# EAGLE design ASD2501 (EAGLE 6.3)
DATABASE: ./../../../../../Components/TinyCircuits_Part_Database.txt
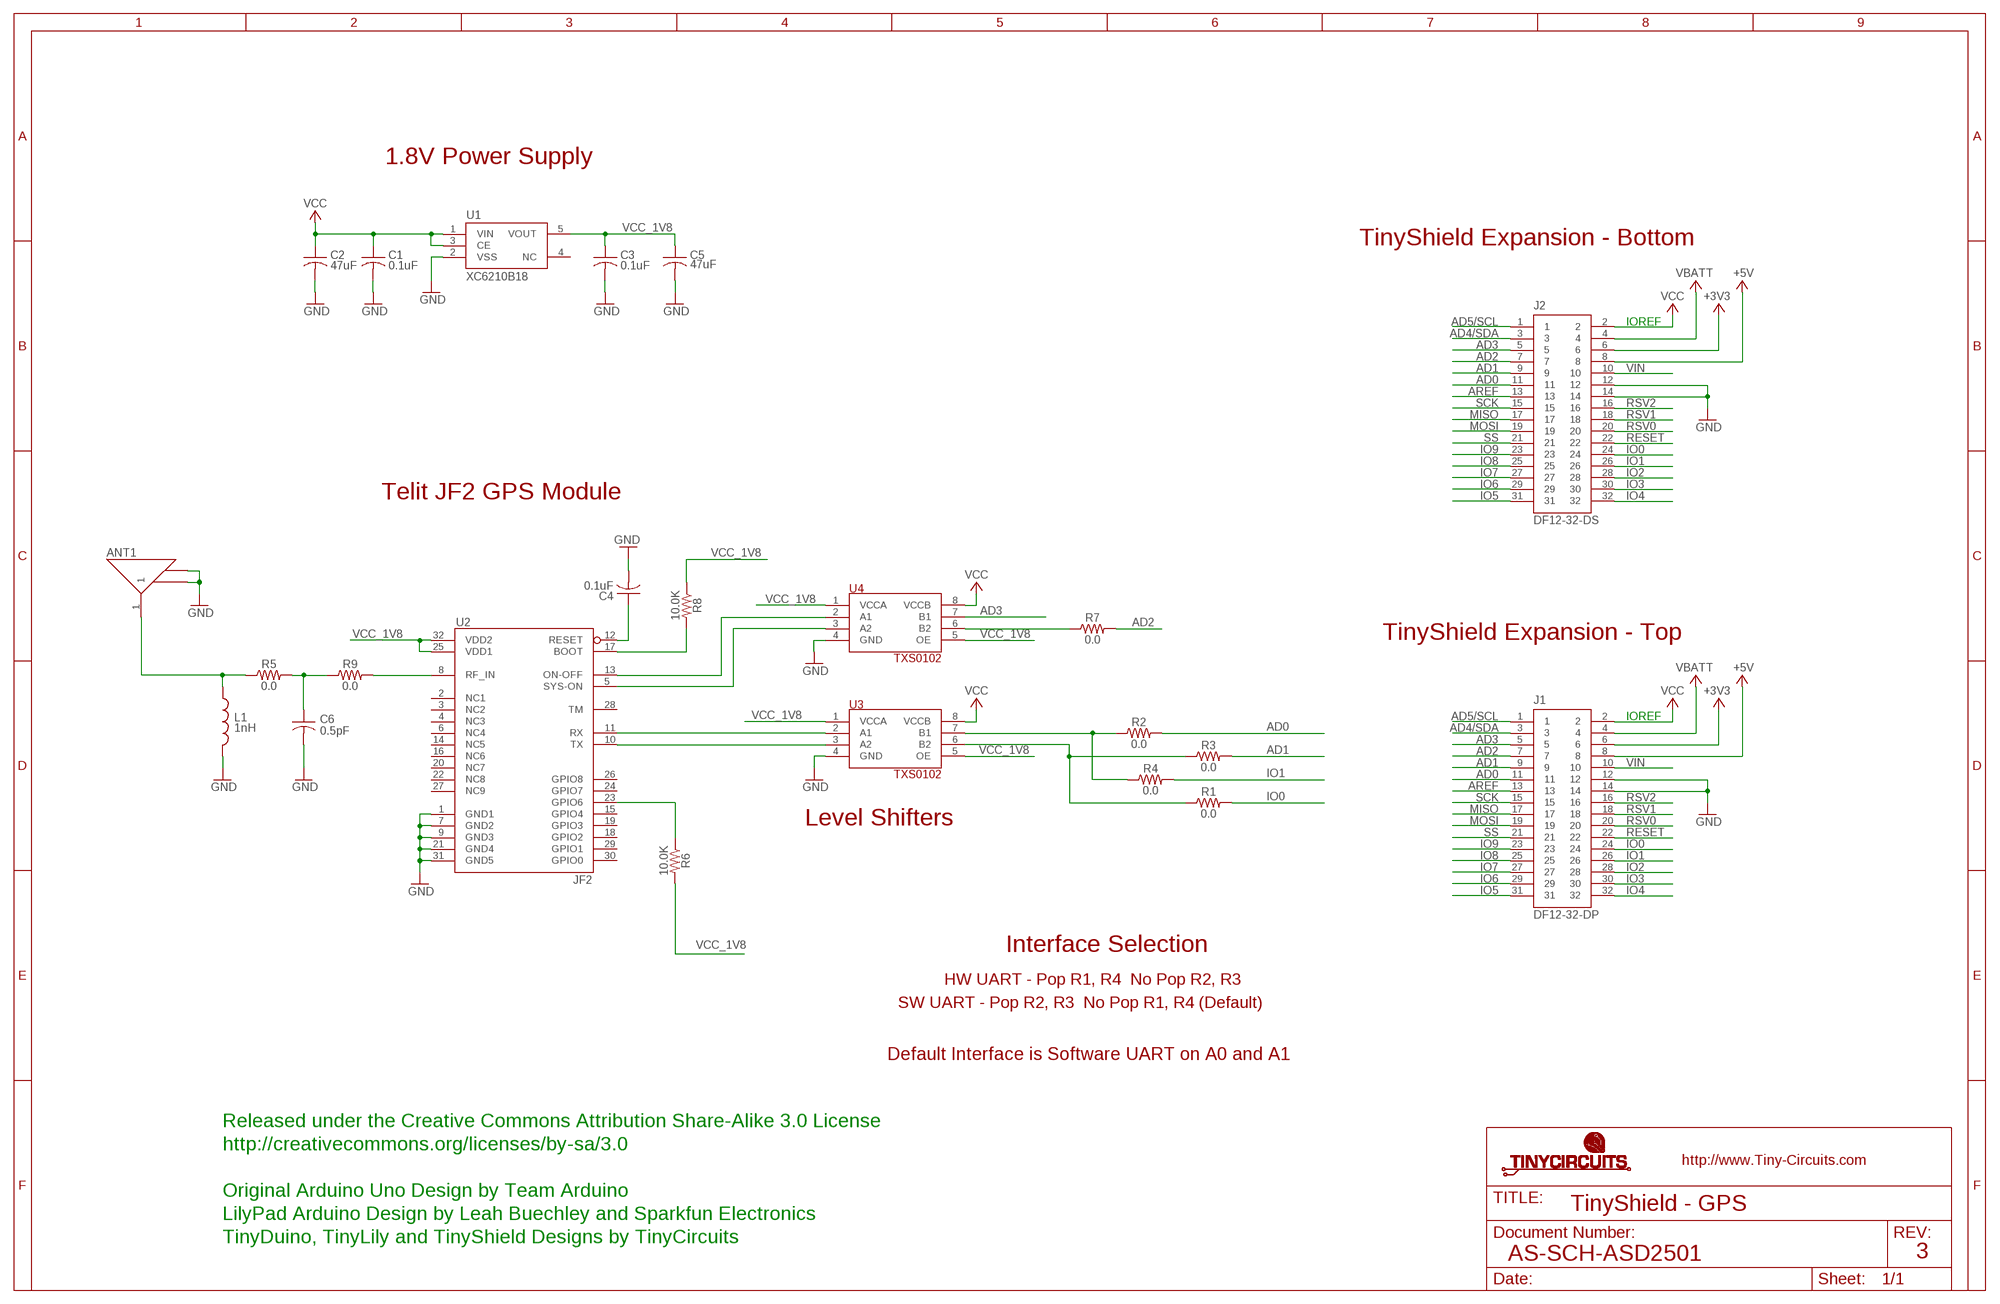
[diagram p0: schematic, sheet 1]

## Parts
ANT1  AS-ITM-00109  [W3011]
C1  0.1uF  AS-ITM-00008  [C0402]
C2  47uF  AS-ITM-00049  [C1206]
C3  0.1uF  AS-ITM-00008  [C0402]
C4  0.1uF  AS-ITM-00008  [C0402]
C5  47uF  AS-ITM-00049  [C1206]
C6  0.5pF  AS-ITM-00126  [C0402]
J1  DF12-32-DP  AS-ITM-00015  [DF12-32-DP]
J2  DF12-32-DS  AS-ITM-00012  [DF12-32-DS]
L1  1nH  AS-ITM-00127  [0402]
R1  0.0  AS-ITM-00076  [0402]
R2  0.0  AS-ITM-000760402_SHORT  [0402_SHORT]
R3  0.0  AS-ITM-000760402_SHORT  [0402_SHORT]
R4  0.0  AS-ITM-00076  [0402]
R5  0.0  AS-ITM-00076  [0402]
R6  10.0K  AS-ITM-00032  [0402]
R7  0.0  AS-ITM-00076  [0402]
R8  10.0K  AS-ITM-00032  [0402]
R9  0.0  AS-ITM-00076  [0402]
U1  XC6210B18  AS-ITM-00075  [SOT-25]
U2  JF2  AS-ITM-00077  [JF2]
U3  TXS0102  AS-ITM-00073  [DQE(R-PX2SON-N8)]
U4  TXS0102  AS-ITM-00073  [DQE(R-PX2SON-N8)]

## Nets
+3V3: J1.6 J2.6
+5V: J1.8 J2.8
AD0: J1.11 J2.11 R2.2
AD1: J1.9 J2.9 R3.2
AD2: J1.7 J2.7 R7.2
AD3: J1.5 J2.5 U4.7(B1)
AD4/SDA: J1.3 J2.3
AD5/SCL: J1.1 J2.1
AREF: J1.13 J2.13
GND: ANT1.2(G1) ANT1.3(G2) C1.2 C2.2 C3.2 C4.2 C5.2 C6.2 J1.12 J1.14 J2.12 J2.14 L1.2 U1.2(VSS) U2.1(GND1) U2.7(GND2) U2.9(GND3) U2.21(GND4) U2.31(GND5) U3.4(GND) U4.4(GND)
IO0: J1.24 J2.24 R1.2
IO1: J1.26 J2.26 R4.2
IO2: J1.28 J2.28
IO3: J1.30 J2.30
IO4: J1.32 J2.32
IO5: J1.31 J2.31
IO6: J1.29 J2.29
IO7: J1.27 J2.27
IO8: J1.25 J2.25
IO9: J1.23 J2.23
MISO: J1.17 J2.17
MOSI: J1.19 J2.19
N$1: C6.1 R5.2 R9.1
N$2: R2.1 R4.1 U3.7(B1)
N$3: R1.1 R3.1 U3.6(B2)
N$4: U2.11(RX) U3.2(A1)
N$5: ANT1.1 L1.1 R5.1
N$6: R6.1 U2.23(GPIO6)
N$7: U2.10(TX) U3.3(A2)
N$8: C4.1 U2.12(RESET)
N$9: R9.2 U2.8(RF_IN)
N$10: R8.2 U2.17(BOOT)
N$11: U2.13(ON-OFF) U4.2(A1)
N$12: U2.5(SYS-ON) U4.3(A2)
N$13: R7.1 U4.6(B2)
RESET: J1.22 J2.22
RSV0: J1.20 J2.20
RSV1: J1.18 J2.18
RSV2: J1.16 J2.16
SCK: J1.15 J2.15
SS: J1.21 J2.21
VBATT: J1.4 J2.4
VCC: C1.1 C2.1 J1.2 J2.2 U1.1(VIN) U1.3(CE) U3.8(VCCB) U4.8(VCCB)
VCC_1V8: C3.1 C5.1 R6.2 R8.1 U1.5(VOUT) U2.25(VDD1) U2.32(VDD2) U3.1(VCCA) U3.5(OE) U4.1(VCCA) U4.5(OE)
VIN: J1.10 J2.10
Unconnected: U1.4(NC) U2.2(NC1) U2.3(NC2) U2.4(NC3) U2.6(NC4) U2.14(NC5) U2.15(GPIO4) U2.16(NC6) U2.18(GPIO2) U2.19(GPIO3) U2.20(NC7) U2.22(NC8) U2.24(GPIO7) U2.26(GPIO8) U2.27(NC9) U2.28(TM) U2.29(GPIO1) U2.30(GPIO0)

## Notes on the sheet
- 1.8V Power Supply
- TinyShield Expansion - Bottom
- IOREF
- Telit JF2 GPS Module
- TinyShield Expansion - Top
- IOREF
- Level Shifters
- Interface Selection
- HW UART - Pop R1, R4  No Pop R2, R3
- SW UART - Pop R2, R3  No Pop R1, R4 (Default)
- Default Interface is Software UART on A0 and A1
- Released under the Creative Commons Attribution Share-Alike 3.0 License
- http://creativecommons.org/licenses/by-sa/3.0
- Original Arduino Uno Design by Team Arduino
- TinyShield - GPS
- LilyPad Arduino Design by Leah Buechley and Sparkfun Electronics
- TinyDuino, TinyLily and TinyShield Designs by TinyCircuits
- AS-SCH-ASD2501 | 3

## Library data of the parts
ANT1 = tinycircuits:AS-ITM-00109: ANTENNA GPS CERAMIC 1.575GHZ; PARTNO: AS-ITM-00109; VALUE: W3011A
C1 C3 C4 = tinycircuits:AS-ITM-00008: CAP CER 0.1UF 16V 10% X5R 0402; PARTNO: AS-ITM-00008
C2 C5 = tinycircuits:AS-ITM-00049: CAP CER 47UF 6.3V 20% X6S 1206; PARTNUM: AS-ITM-00049
C6 = tinycircuits:AS-ITM-00126: CAP CER 0.5PF 16V 0.1% 0402
J1 = tinycircuits:AS-ITM-00015: CONN HEADER 32POS 3MM SMD 0.5MM; PARTNO: AS-ITM-00015
J2 = tinycircuits:AS-ITM-00012: CONN RECEPT 32POS 3MM SMD 0.5MM; PARTNO: AS-ITM-00012
L1 = tinycircuits:AS-ITM-00127: INDUCTOR 1NH
R1 R4 R5 R7 R9 = tinycircuits:AS-ITM-00076: RES 0.0 OHM 1/16W 1% 0402 SMD; PARTNO: AS-ITM-00076
R2 R3 = tinycircuits:AS-ITM-00076: RES 0.0 OHM 1/16W 1% 0402 SMD
R6 R8 = tinycircuits:AS-ITM-00032: RES 10.0K OHM 1/16W 1% 0402 SMD; PARTNO: AS-ITM-00032
U1 = tinycircuits:AS-ITM-00075: IC REG LDO 1.8V .7A SOT-25; PARTNO: AS-ITM-00075
U2 = tinycircuits:AS-ITM-00077: Telit JF2 GPS Module; PARTNO: AS-ITM-00077
U3 U4 = tinycircuits:AS-ITM-00073: TI 2-Bit Bidirectional Voltage-Level Translator; PARTNO: AS-ITM-00073

## Board
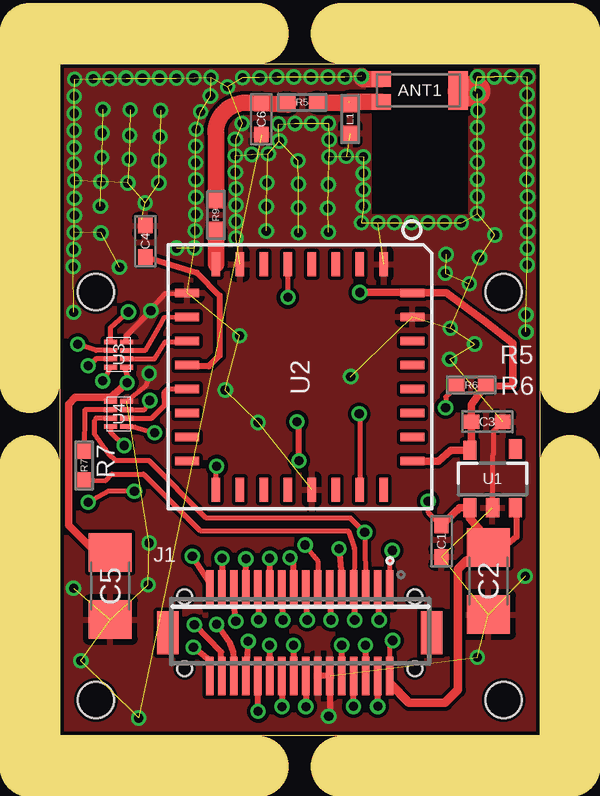
[diagram p1: board, top side]
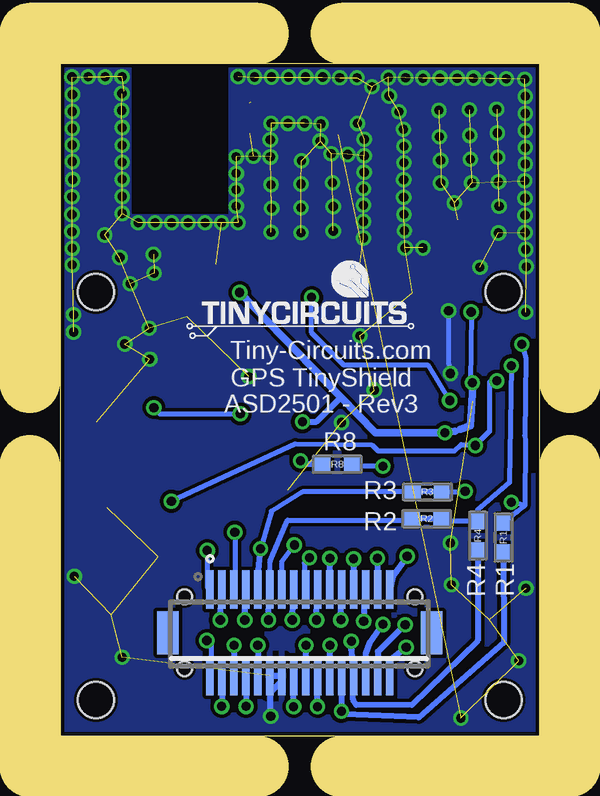
[diagram p2: board, bottom side, seen from below]

Size 20 x 28 mm. Coordinates in mm from the lower left corner, seen from the top.
Outline: 0,28 20,28 20,0 0,0 0,28
Copper layers (1*16): Top 0.035mm / dielectric 1.5mm / Bottom 0.035mm
Design rules "default *": minimum track width 8mil, minimum drill 15mil, track to track 6mil, track to pad 6mil, pad to pad 6mil, via to via 6mil, smd to smd 6mil, copper to edge 6mil, drill to drill 8mil, minimum pad ring 10mil, minimum via ring 5mil, stop-mask expansion 4mil, vias tented up to drill 25mil, thermal gap 10mil
Holes 1.5 mm at 1.5,18.5 18.5,18.5 18.5,1.5 1.5,1.5
tRestrict: area 13,21.8 to 17,28
bRestrict: area 13,21.8 to 17,28
Milling: 8 lines

### Footprints (pad centres in the part's own frame; a part is rotated, then mirrored left to right if it is on the bottom)
W3011 = smd 0.8 x 0.65: 1 1.6,0.475; 2 1.6,-0.475 | smd 0.8 x 1.6: 3 -1.6,0
C0402 = smd 0.65 x 0.6: 1 -0.65,0; 2 0.65,0
C1206 = smd 1.6 x 1.8: 1 -1.4,0; 2 1.4,0
DF12-32-DP = smd 0.3 x 1.6: 1 -3.75,-1.8; 2 -3.75,1.8; 3 -3.25,-1.8; 4 -3.25,1.8; 5 -2.75,-1.8; 6 -2.75,1.8; 7 -2.25,-1.8; 8 -2.25,1.8; 9 -1.75,-1.8; 10 -1.75,1.8; 11 -1.25,-1.8; 12 -1.25,1.8; 13 -0.75,-1.8; 14 -0.75,1.8; 15 -0.25,-1.8; 16 -0.25,1.8; 17 0.25,-1.8; 18 0.25,1.8; 19 0.75,-1.8; 20 0.75,1.8; 21 1.25,-1.8; 22 1.25,1.8; 23 1.75,-1.8; 24 1.75,1.8; 25 2.25,-1.8; 26 2.25,1.8; 27 2.75,-1.8; 28 2.75,1.8; 29 3.25,-1.8; 30 3.25,1.8; 31 3.75,-1.8; 32 3.75,1.8 | smd 0.9 x 1.8: F1 -5.5,0; F2 5.5,0 | hole 0.6: -4.8,1.5; 4.8,1.5
DF12-32-DS = smd 0.3 x 1.6: 1 -3.75,1.8; 2 -3.75,-1.8; 3 -3.25,1.8; 4 -3.25,-1.8; 5 -2.75,1.8; 6 -2.75,-1.8; 7 -2.25,1.8; 8 -2.25,-1.8; 9 -1.75,1.8; 10 -1.75,-1.8; 11 -1.25,1.8; 12 -1.25,-1.8; 13 -0.75,1.8; 14 -0.75,-1.8; 15 -0.25,1.8; 16 -0.25,-1.8; 17 0.25,1.8; 18 0.25,-1.8; 19 0.75,1.8; 20 0.75,-1.8; 21 1.25,1.8; 22 1.25,-1.8; 23 1.75,1.8; 24 1.75,-1.8; 25 2.25,1.8; 26 2.25,-1.8; 27 2.75,1.8; 28 2.75,-1.8; 29 3.25,1.8; 30 3.25,-1.8; 31 3.75,1.8; 32 3.75,-1.8 | smd 0.9 x 1.8: F1 -5.5,0; F2 5.5,0 | hole 0.6: -4.8,1.5; 4.8,1.5
0402 = smd 0.65 x 0.55: 1 -0.6,0; 2 0.6,0
0402_SHORT = smd 0.65 x 0.55: 1 -0.6,0; 2 0.6,0
SOT-25 = smd 0.55 x 0.8: 1 -0.95,-1.2; 2 0,-1.2; 3 0.95,-1.2; 4 0.95,1.25; 5 -0.95,1.2
JF2 = smd 1 x 0.35: 1 -4.7,3.5; 2 -4.7,2.5; 3 -4.7,1.5; 4 -4.7,0.5; 5 -4.7,-0.5; 6 -4.7,-1.5; 7 -4.7,-2.5; 8 -4.7,-3.5; 17 4.7,-3.5; 18 4.7,-2.5; 19 4.7,-1.5; 20 4.7,-0.5; 21 4.7,0.5; 22 4.7,1.5; 23 4.7,2.5; 24 4.7,3.5 | smd 0.35 x 1: 9 -3.5,-4.7; 10 -2.5,-4.7; 11 -1.5,-4.7; 12 -0.5,-4.7; 13 0.5,-4.7; 14 1.5,-4.7; 15 2.5,-4.7; 16 3.5,-4.7; 25 3.5,4.7; 26 2.5,4.7; 27 1.5,4.7; 28 0.5,4.7; 29 -0.5,4.7; 30 -1.5,4.7; 31 -2.5,4.7; 32 -3.5,4.7
DQE(R-PX2SON-N8) = smd 0.2 x 0.53: 1 -0.525,-0.335; 2 -0.175,-0.335; 3 0.175,-0.335; 4 0.525,-0.335; 5 0.525,0.335; 6 0.175,0.335; 7 -0.175,0.335; 8 -0.525,0.335

### Placement (x,y rotation side)
ANT1  15,26.89 180 top
C1  15.91,8.11 270 top
C2  17.86,6.45 270 top
C3  17.81,13.09 0 top
C4  3.56,20.61 90 top
C5  2.1,6.24 270 top
C6  8.4,25.7 270 top
J1  10,4.3 180 top
J2  10,4.3 0 bottom
L1  12.1,25.7 270 top
R1  1.51,8.26 270 bottom
R2  4.71,9.05 180 bottom
R3  4.68,10.17 180 bottom
R4  2.57,8.34 270 bottom
R5  10.1,26.4 180 top
R6  17.15,14.61 0 top
R7  1.01,11.26 270 top
R8  8.44,11.31 0 bottom
R9  6.5,21.7 270 top
U1  18.04,10.7 0 top
U2  10,14.95 270 top
U3  2.45,15.88 90 top
U4  2.45,13.41 90 top
U$1  [DOCFIELD-TINYCIRCUITS-PCB]  33.91,-10 0 top  (outside the outline)

### Tracks (layer width: path | path; a pad name or v marks a point on that pad's centre or on a via)
+3V3  (via drill 0.38)
  Top 0.254: J2.6 v12.75,3.77 v12.74,3.77
  Bottom 0.254: v12.74,3.77 12.74,2.51 J2.6
+5V  (via drill 0.38)
  Top 0.254: v12.24,1.23 J2.8
  Bottom 0.254: J2.8 12.25,1.21 v12.24,1.23
AD0  (via drill 0.38)
  Top 0.254: v11.3,4.83 11.31,5.05 J2.11
  Bottom 0.203: J2.11 11.22,6.1 11.24,7.27 10.5,8.99 5.37,8.99 R2.2
  Bottom 0.254: J2.11 11.28,5.79 v11.3,4.83
AD1  (via drill 0.38)
  Top 0.254: J2.9 11.79,6.27 v11.63,7.8
  Bottom 0.203: R3.2 9.89,10.17 11.18,9.36 11.6,7.92 v11.63,7.8
  Bottom 0.254: v11.63,7.8 11.78,6.22 J2.9
AD2  (via drill 0.38)
  Top 0.203: R7.2 1.9,10.64 2.17,10.9 3.49,10.9 5.85,8.55 12.03,8.54 12.28,7.81 J2.7
  Top 0.254: v12.29,4.83 12.31,5.05 J2.7
  Bottom 0.254: J2.7 12.27,5.86 v12.29,4.83
AD3  (via drill 0.38)
  Top 0.203: U4.7 2.06,13.24 1.51,13.24 1.43,13.11 1.43,12.58 1.89,11.95 2.04,11.74 2.32,11.46 3.72,11.46 6.1,9.07 12.12,9.07 v12.71,8.49 12.73,8.44 J2.5
  Bottom 0.203: 12.75,6.44 J2.5 12.71,6.14 v12.71,8.49
AD4/SDA  (via drill 0.38)
  Top 0.254: v13.31,4.83 13.31,5 J2.3
  Bottom 0.254: J2.3 13.28,5.86 v13.31,4.83
AD5/SCL  (via drill 0.38)
  Top 0.203: J2.1 13.75,7.61 v13.86,7.72
  Bottom 0.203: v13.86,7.72 13.86,6.21 J2.1
AREF  (via drill 0.38)
  Top 0.203: v10.23,7.95 10.55,7.53 10.75,7.27 J2.13
  Bottom 0.203: J2.13 10.75,7.27 v10.23,7.95
GND  (via drill 0.38)  (152 unrouted)
  Top 0.203: U2.9 4.38,18.42 2.76,16.6 U3.4 2.77,16.41 2.75,16.59 2.75,16.67 v3.79,17.71 | C3.2 18.07,12.69 18.07,11.72 18.04,11.69 U1.2 | v3.72,15.09 3.56,14.57 U4.4
  Top 0.254: J2.12 J2.14 | J2.12 11.25,1.04 11.21,1 v11.21,0.82 | v11.21,0.82 11.21,0.79 11.23,0.77 | J2.12 11.25,0.86 v11.21,0.82 | C4.2 3.61,21.3 3.41,21.5
  Top 0.686: ANT1.2 12.69,27.36 arc-90 v12.57,27.48 | ANT1.3 16.77,26.89 arc-90 16.8,26.85 | 17.32,26.85 arc-90 v17.41,26.76
  Top 1.27: 16.8,26.85 17.32,26.85
  Bottom 0.203: v3.79,17.71 3.79,15.55 v3.72,15.09
  Bottom 0.254: J2.12 J2.14 10.75,2.29 11.25,1.79 11.25,0.86 v11.21,0.82
  other vias: 5.66,23.17 5.66,22.44 5.66,21.73 0.57,6.15 0.87,3.13 3.28,0.74 3.72,8.03 6.89,14.41 12.12,14.97 0.6,22.4 16.74,21.38 0.61,23.13 4.86,27.41 5.59,27.42 19.4,6.65 6.3,27.43 3.55,22.21 5.68,25.28 19.47,23.18 19.5,22.46 19.48,20.31 17.29,16.33 17.4,3.27 3.68,6.29 8.26,13.06 7.49,16.67 2.48,19.52 17.41,27.47 17.43,26.05 18.11,27.46 18.82,27.47 19.5,27.45 19.48,26.72 19.49,26.02 19.49,25.31 19.49,24.62 16.25,15.69 16.28,16.99 17.41,25.34 17.41,24.61 17.41,23.9 17.41,23.18 17.41,22.47 17.41,21.76 19.49,23.93 19.5,21.72 19.5,21.01 19.48,19.62 19.43,17.54 19.43,16.83 16.08,19.27 16.1,20.06 16.03,21.38 15.34,21.38 14.66,21.38 13.94,21.38 13.26,21.38 12.57,21.38 12.65,22.06 12.65,22.75 12.65,23.44 12.65,24.12 11.94,24.15 11.23,24.12 11.23,24.83 11.2,25.52 10.49,25.52 9.8,25.52 9.12,25.49 9.14,24.78 8,24.22 8.69,24.25 7.32,24.17 7.59,25.52 7.32,24.86 7.32,23.49 7.34,22.8 7.34,22.12 7.34,21.43 7.34,20.74 11.89,27.45 11.18,27.45 10.46,27.45 9.75,27.45 9.04,27.45 8.33,27.42 7.62,27.42 6.98,27.04 6.27,26.66 5.87,26 5.65,24.57 5.65,23.88 5.63,21.04 5.61,20.33 4.87,20.33 9.93,23.96 8.63,23.04 9.95,22.99 11.2,22.97 8.61,22.05 8.61,21.04 9.95,22 9.95,20.96 11.17,21.98 11.2,20.99 18.14,20.87 17.5,19.93 17.07,18.84 4.15,27.41 3.44,27.41 2.75,27.41 2.07,27.38 1.38,27.38 0.62,27.36 0.59,26.64 0.59,25.93 0.59,25.22 0.59,24.51 0.59,23.82 0.6,21.69 0.6,20.97 0.58,20.26 0.55,19.55 0.58,17.65 1.79,26.11 2.93,26.09 4.2,26.06 1.76,25.12 1.74,24.1 1.71,23.09 1.69,22.07 1.71,20.95 2.91,25.02 2.88,24.03 4.18,24.97 4.12,23.98 2.83,23.04 4.12,23.04
  pour Top: 0.25,27.75 19.75,27.75 19.75,0.25 0.25,0.25
  pour Bottom: 0.25,27.75 19.75,27.75 19.75,0.25 0.25,0.25
IO0  (via drill 0.38)
  Top 0.254: v8.26,1.02 8.25,0.85 J2.24
  Bottom 0.254: J2.24 8.24,2.5 v8.26,1.02 8.19,0.9 5.04,0.77 1.48,3.89 R1.2
IO1  (via drill 0.38)
  Top 0.254: v7.85,3.94 J2.26
  Bottom 0.254: J2.26 7.85,3.66 | J2.26 v7.85,3.94 | R4.2 2.57,3.97 5.34,1.28 7.64,1.29 7.78,1.51 7.78,2.47 J2.26
IO2  (via drill 0.38)
  Top 0.254: v6.53,4.64 7.07,3.89 7.22,3.49 7.29,2.61 7.26,2.51 J2.28
  Bottom 0.254: J2.28 7.24,3.43 7.07,3.88 v6.53,4.64
IO3  (via drill 0.38)
  Top 0.254: J2.30 6.73,3.49 v5.61,4.63
  Bottom 0.254: v5.61,4.63 6.75,3.51 6.77,2.53 J2.30
IO4  (via drill 0.38)
  Top 0.254: J2.32 6.25,3.14 v5.56,3.69
  Bottom 0.254: v5.56,3.69 5.61,3.65 6.21,3.18 6.21,3.14 6.26,3.1 J2.32
IO5  (via drill 0.38)
  Top 0.254: v5.52,7.49 6.23,6.38 J2.31
  Bottom 0.254: J2.31 6.11,6.64 v5.52,7.49
IO6  (via drill 0.38)
  Top 0.254: J2.29 6.76,6.11 v6.76,7.4
  Bottom 0.254: J2.29 6.75,7.39 v6.76,7.4
IO7  (via drill 0.38)
  Top 0.254: v7.33,4.78 7.31,4.9 J2.27
  Bottom 0.254: J2.27 7.29,5.76 v7.33,4.78
IO8  (via drill 0.38)
  Top 0.254: J2.25 v7.75,7.37
  Bottom 0.254: v7.75,7.37 J2.25
IO9  (via drill 0.38)
  Top 0.254: v8.29,4.83 8.31,4.98 J2.23
  Bottom 0.254: J2.23 8.28,5.59 v8.29,4.83
MISO  (via drill 0.38)
  Top 0.254: J2.17 9.75,7.29 v9.59,7.42
  Bottom 0.203: v9.59,7.42 9.56,7.33 9.8,7.21 9.8,6.15 J2.17
  Bottom 0.254: 9.74,6.11 J2.17
MOSI  (via drill 0.38)
  Top 0.254: v9.3,4.83 9.31,4.95 J2.19
  Bottom 0.254: J2.19 9.27,5.76 v9.3,4.83
N$1
  Top 0.406: 9.4,26.38 9.4,26.4 R5.2 9.5,26.3 | 6.49,25.12 6.5,25.12 | 8.35,26.38 8.4,26.38 C6.1
  Top 0.686: 9.4,26.38 9.5,26.38 | 6.49,25.12 arc-90 7.75,26.38 8.35,26.38 | 6.5,25.12 R9.1 | C6.1 9.5,26.3
N$2  (via drill 0.38)
  Top 0.203: U3.7 1.51,15.7 1.33,15.53 1.23,15.45 1.25,15.4 v1.18,15.43
  Bottom 0.203: v1.18,15.43 1.25,10.55 2.57,9.43 R4.1 3.99,8.94 R2.1
N$3  (via drill 0.38)
  Top 0.203: U3.6 1.5,16.06 v0.74,16.31 | v3.11,10.19 2.01,10.19 v1.18,9.74
  Bottom 0.203: v0.74,16.31 0.57,15.73 0.62,12.5 0.59,12.3 0.62,9.58 | 0.62,9.58 0.95,9.33 1.49,8.86 R1.1 | R3.1 3.13,10.17 v3.11,10.19 | v1.18,9.74 0.92,9.71 0.62,9.58
N$4
  Top 0.203: U3.2 3.1,15.71 3.69,15.71 3.94,15.71 4.38,16.42 5.26,16.42 U2.11
N$5  (1 unrouted)
  Top 0.406: 10.7,26.38 R5.1 | 12.1,26.38 L1.1
  Top 0.686: ANT1.1 12.03,26.41 | 10.7,26.38 12.1,26.38
N$6  (via drill 0.38)
  Top 0.203: R6.1 16.09,14.12 v16.09,13.67 | v12.48,13.42 12.5,13.4 U2.23
  Bottom 0.203: v16.09,13.67 15.83,13.42 v12.48,13.42
N$7
  Top 0.203: U3.3 3.56,16.07 4.17,17.1 4.35,17.43 U2.10
N$8
  Top 0.254: C4.1 5.71,19.3 6.66,18.35 6.66,15.86 6.2,15.4 5.36,15.4 U2.12
N$9
  Top 0.406: R9.2 6.5,20.9
  Top 0.686: U2.8 6.5,20.9 6.5,20.99
N$10  (via drill 0.38)
  Top 0.203: U2.17 6.5,11.2 v6.54,11.23
  Bottom 0.203: v6.54,11.23 7.65,11.23 7.84,11.22 7.83,11.22 R8.2
N$11
  Top 0.203: U4.2 3.82,13.24 4.36,13.77 4.35,14.31 4.5,14.45 U2.13
N$12  (via drill 0.38)
  Top 0.203: U4.3 2.8,13.59 3.52,13.59 3.74,13.93 v3.75,13.97 | v9.51,18.27 v9.5,18.28 U2.5
  Bottom 0.203: v3.75,13.97 4.64,15.44 8.16,15.45 9.51,16.8 v9.51,18.27
N$13
  Top 0.203: U4.6 2.08,13.59 1.04,13.58 1.04,13.53 R7.1
RESET  (via drill 0.38)
  Top 0.254: v8.74,3.77 J2.22
  Bottom 0.254: J2.22 8.75,3.69 v8.74,3.77
RSV0  (via drill 0.38)
  Top 0.254: J2.20 9.25,1.2 v9.26,1.22
  Bottom 0.254: v9.26,1.22 J2.20
RSV1  (via drill 0.38)
  Top 0.254: v9.74,3.77 9.74,2.51 J2.18
  Bottom 0.254: J2.18 9.75,3.72 v9.74,3.77
RSV2  (via drill 0.38)
  Top 0.254: J2.16 10.25,1.16 v10.25,1.22
  Bottom 0.254: v10.25,1.22 J2.16
SCK  (via drill 0.38)
  Top 0.254: v10.31,4.83 10.31,4.98 J2.15
  Bottom 0.254: J2.15 10.29,5.66 v10.31,4.83
SS  (via drill 0.38)
  Top 0.254: v8.75,7.4 J2.21
  Bottom 0.254: J2.21 v8.75,7.39 v8.75,7.4
VBATT  (via drill 0.38)
  Top 0.254: v13.25,1.23 J2.4
  Bottom 0.254: J2.4 13.25,1.24 v13.25,1.23
VCC  (via drill 0.38)
  Top 0.203: 13.75,2.19 J2.2 13.75,3.84 v13.88,3.97 | 17.84,7.32 C2.1 | U1.1 17.09,9.45 17.09,9.07 | 16.55,9.41 16.57,9.41 | U3.8 1.81,14.74 v1.79,14.79 | U4.8 2.11,12.66 v2.68,12.1 | v15.35,9.77 15.35,9.32 C1.1
  Top 0.254: U1.3 18.97,9.6 19.03,9.46 19.03,8.29 18.27,7.65 C2.1
  Top 0.305: C1.1 16.55,9.41 | 16.57,9.41 16.66,9.5 U1.1
  Top 0.356: 13.75,2.19 14.56,1.38 16.06,1.38 16.59,1.91 16.59,6.94 16.98,7.32 17.84,7.32 | 17.09,9.07 17.89,8.14 C2.1
  Bottom 0.203: v13.88,3.97 13.82,3.97 13.7,3.84 13.7,2.55 J2.2 | v15.35,9.77 10.16,12.17 6.99,12.13 6.73,11.87 3.54,11.87 3.28,12.14 2.71,12.14 v2.68,12.1 2.09,12.68 2.09,14.74 v1.79,14.79
VCC_1V8  (via drill 0.38)
  Top 0.203: U1.5 17.16,11.97 | 17.2,13.85 17.16,13.8 | 14.87,11.44 U2.25 14.7,11.42 14.69,11.41 | 18,14.56 R6.2 | U4.1 3.13,12.86 v3.95,12.63 | 14.68,18.47 U2.32 | U3.5 2.11,17.02 v2.85,17.66 | 2.11,14.1 2.75,14.66 v2.8,14.71 2.11,14.1 | 2.8,14.69 2.83,14.74 2.83,14.99 2.72,15.3 U3.1 | 2.11,14.1 U4.5 2.23,14.11 | C5.1 1.49,7.64
  Top 0.254: v9.96,11.46 9.96,13.01 v9.89,13.09
  Top 0.305: 17.16,11.97 C3.1 17.16,13.8 | R6.2 17.2,13.85 | U1.5 16.3,11.9 15.78,11.44 14.87,11.44 | U2.32 16.1,18.45 17.48,17.43 17.71,17.28 18.88,16.36 18.88,14.59 18,14.56 | v12.5,18.47 14.68,18.47 | 2.11,14.1 2.8,14.69 | 1.49,7.64 0.36,8.77 0.36,13.82 0.64,14.11 2.23,14.11
  Bottom 0.203: v2.85,17.66 2.88,14.66 v2.8,14.71 2.78,14.56 | 3.54,12.68 3.23,12.78 3.31,12.78
  Bottom 0.254: R8.1 9.94,11.31 v9.96,11.46 | v9.89,13.09 9.29,13.09 8.27,14.11
  Bottom 0.305: v12.5,18.47 8.27,14.11 6.84,12.63 v3.95,12.63 3.54,12.68 | 3.31,12.78 2.88,12.91 2.78,14.56
VIN  (via drill 0.38)
  Top 0.254: J2.10 v11.76,3.78 v11.75,3.78
  Bottom 0.254: v11.75,3.78 J2.10

### Text on the board
tPlace: R5 | R6 | R7
bPlace: Tiny-Circuits.com | GPS TinyShield | ASD2501 - Rev3 | R8 | R3 | R2 | R1 | R4
Document: FABRICATION DRAWING | NOTES: | 1. PRINTED CIRCUIT BOARD MADE FROM NEMA GRADE FR-4 EPOXY LAMINATE | WITH 1 OUNCE COPPER PLATING AND .024 THICKNESS. | 2. ALL DIMENSIONS ARE GIVEN IN INCHES. | 3. CIRCUIT PATHS ARE FOR REFERENCE ONLY. | 4. HOLE SIZES SHOWN ARE FINISHED DIAMETERS AFTER PLATING. | 5. BOARD PLATED USING REFLOW OR SIMILAR METHOD. | 6. BOARD TO HAVE BLUE SOLDER MASK ON PLATED SURFACES USING WET FILM | 7. SILKSCREEN BOARD USING WHITE INK. | SR100 OR SR1010 EPOXY. EQUIVALENT WET OR DRY FILM MAY BE USED. | 8. THE FOLLOWING INFORMATION APPLIES TO THIS BOARD: | * 2 COPPER LAYERS | * .024 BOARD THICKNESS | * REQUIRES TOP SIDE SILKSCREEN | Released under the Creative Commons Attribution Share-Alike 3.0 License | http://creativecommons.org/licenses/by-sa/3.0 | Original Arduino Uno Design by Team Arduino | LilyPad Arduino Design by Leah Buechley and Sparkfun Electronics | TinyDuino, TinyLily and TinyShield Designs by TinyCircuits | TinyShield - GPS | AS-PCB-ASD2501 | 3